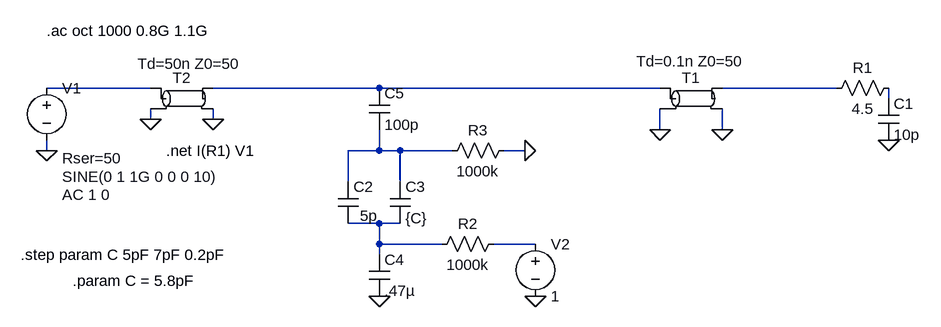
[diagram p0: schematic TunableMatchingVariableTipBias.asc]
TunableMatchingVariableTipBias.asc, the LTspice schematic file:
Version 4
SHEET 1 1848 680
WIRE -208 80 -368 80
WIRE 144 80 -112 80
WIRE 576 80 144 80
WIRE 848 80 672 80
WIRE 928 96 928 80
WIRE -208 128 -208 112
WIRE -112 128 -112 112
WIRE 576 144 576 112
WIRE 672 144 672 112
WIRE -368 176 -368 160
WIRE 144 176 144 144
WIRE 144 176 96 176
WIRE 176 176 144 176
WIRE 256 176 176 176
WIRE 368 176 336 176
WIRE 96 224 96 176
WIRE 176 224 176 176
WIRE 144 288 96 288
WIRE 176 288 144 288
WIRE 144 320 144 288
WIRE 240 320 144 320
WIRE 384 320 320 320
WIRE 144 336 144 320
FLAG -112 128 0
FLAG -368 176 0
FLAG 928 160 0
FLAG -208 128 0
FLAG 576 144 0
FLAG 672 144 0
FLAG 144 400 0
FLAG 384 400 0
FLAG 368 176 0
SYMBOL voltage -368 64 R0
WINDOW 3 24 152 Left 2
WINDOW 123 24 180 Left 2
WINDOW 39 24 124 Left 2
SYMATTR Value SINE(0 1 1G 0 0 0 10)
SYMATTR Value2 AC 1 0
SYMATTR SpiceLine Rser=50
SYMATTR InstName V1
SYMBOL tline -160 96 R0
WINDOW 3 12 -69 Top 2
SYMATTR InstName T2
SYMBOL cap 912 96 R0
SYMATTR InstName C1
SYMATTR Value 10p
SYMBOL cap 80 224 R0
WINDOW 3 34 52 Left 2
SYMATTR Value 5p
SYMATTR InstName C2
SYMBOL tline 624 96 R0
WINDOW 3 -1 -73 Top 2
SYMATTR Value Td=0.1n Z0=50
SYMATTR InstName T1
SYMBOL res 944 64 R90
WINDOW 0 0 56 VBottom 2
WINDOW 3 32 56 VTop 2
SYMATTR InstName R1
SYMATTR Value 4.5
SYMBOL cap 160 224 R0
SYMATTR InstName C3
SYMATTR Value {C}
SYMBOL cap 128 336 R0
SYMATTR InstName C4
SYMATTR Value .47µ
SYMBOL res 336 304 R90
WINDOW 0 0 56 VBottom 2
WINDOW 3 32 56 VTop 2
SYMATTR InstName R2
SYMATTR Value 1000k
SYMBOL voltage 384 304 R0
WINDOW 123 0 0 Left 2
WINDOW 39 0 0 Left 2
SYMATTR InstName V2
SYMATTR Value 1
SYMBOL cap 128 80 R0
SYMATTR InstName C5
SYMATTR Value 100p
SYMBOL res 352 160 R90
WINDOW 0 0 56 VBottom 2
WINDOW 3 32 56 VTop 2
SYMATTR InstName R3
SYMATTR Value 1000k
TEXT -368 -8 Left 2 !.ac oct 1000 0.8G 1.1G
TEXT -184 176 Left 2 !.net I(R1) V1
TEXT -328 376 Left 2 !.param C = 5.8pF
TEXT -408 336 Left 2 !.step param C 5pF 7pF 0.2pF

The netlist it stands for:
* TunableMatchingVariableTipBias.asc
V1 N001 0 SINE(0 1 1G 0 0 0 10) AC 1 0 Rser=50
T2 N001 0 N002 0 Td=50n Z0=50
C1 N004 0 10p
C2 N005 N006 5p
T1 N002 0 N003 0 Td=0.1n Z0=50
R1 N004 N003 4.5
C3 N005 N006 {C}
C4 N006 0 .47µ
R2 N007 N006 1000k
V2 N007 0 1
C5 N002 N005 100p
R3 0 N005 1000k
.ac oct 1000 0.8G 1.1G
.net I(R1) V1
.param C = 5.8pF
.step param C 5pF 7pF 0.2pF
.backanno
.end